# EAGLE design 5V AC-DC reg (EAGLE 9.6.2)
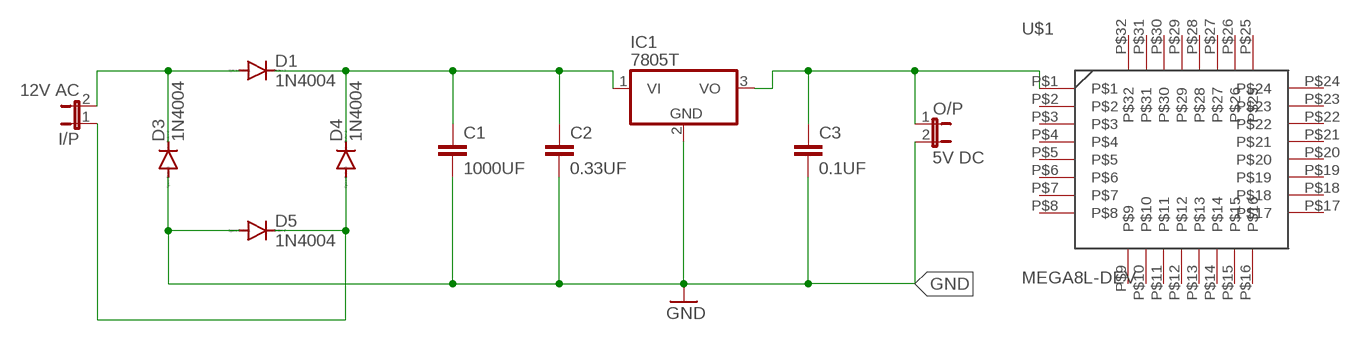
[diagram p0: schematic, sheet 1]

## Parts
C1  1000UF  C2,5-3  [C2.5-3]
C2  0.33UF  C2,5-3  [C2.5-3]
C3  0.1UF  C2,5-3  [C2.5-3]
D1  1N4004  [DO41-10]
D3  1N4004  [DO41-10]
D4  1N4004  [DO41-10]
D5  1N4004  [DO41-10]
I/P  12V AC  JP1E  [JP1]
IC1  7805T  [TO220H]
O/P  5V DC  JP1E  [JP1]
U$1  MEGA8L-DEV  [TQFP-MEGA8L]

## Nets
GND: C1.2 C2.2 C3.2 D3.A D5.A IC1.2(GND) O/P.2
N$1: D1.A D3.C I/P.2
N$2: C1.1 C2.1 D1.C D4.C IC1.1(VI)
N$3: D4.A D5.C I/P.1
N$5: C3.1 IC1.3(VO) O/P.1 U$1.P$1
Unconnected: U$1.P$2 U$1.P$3 U$1.P$4 U$1.P$5 U$1.P$6 U$1.P$7 U$1.P$8 U$1.P$9 U$1.P$10 U$1.P$11 U$1.P$12 U$1.P$13 U$1.P$14 U$1.P$15 U$1.P$16 U$1.P$17 U$1.P$18 U$1.P$19 U$1.P$20 U$1.P$21 U$1.P$22 U$1.P$23 U$1.P$24 U$1.P$25 U$1.P$26 U$1.P$27 U$1.P$28 U$1.P$29 U$1.P$30 U$1.P$31 U$1.P$32

## Library data of the parts
C1-C3 = capacitor-wima:C: CAPACITOR naming: grid - package width
D1 D3-D5 = diode:1N4004: DIODE general purpose rectifier, 1 A
I/P O/P = jumper:JP1E: JUMPER
IC1 = linear:78*: Positive VOLTAGE REGULATOR Source: http://cache.national.com/ds/LM/LM78L05.pdf http://www.fairchildsemi.com/ds/LM/LM7805.pdf
U$1 = SAN-MEGA8L:MEGA8L-DEV

## Board
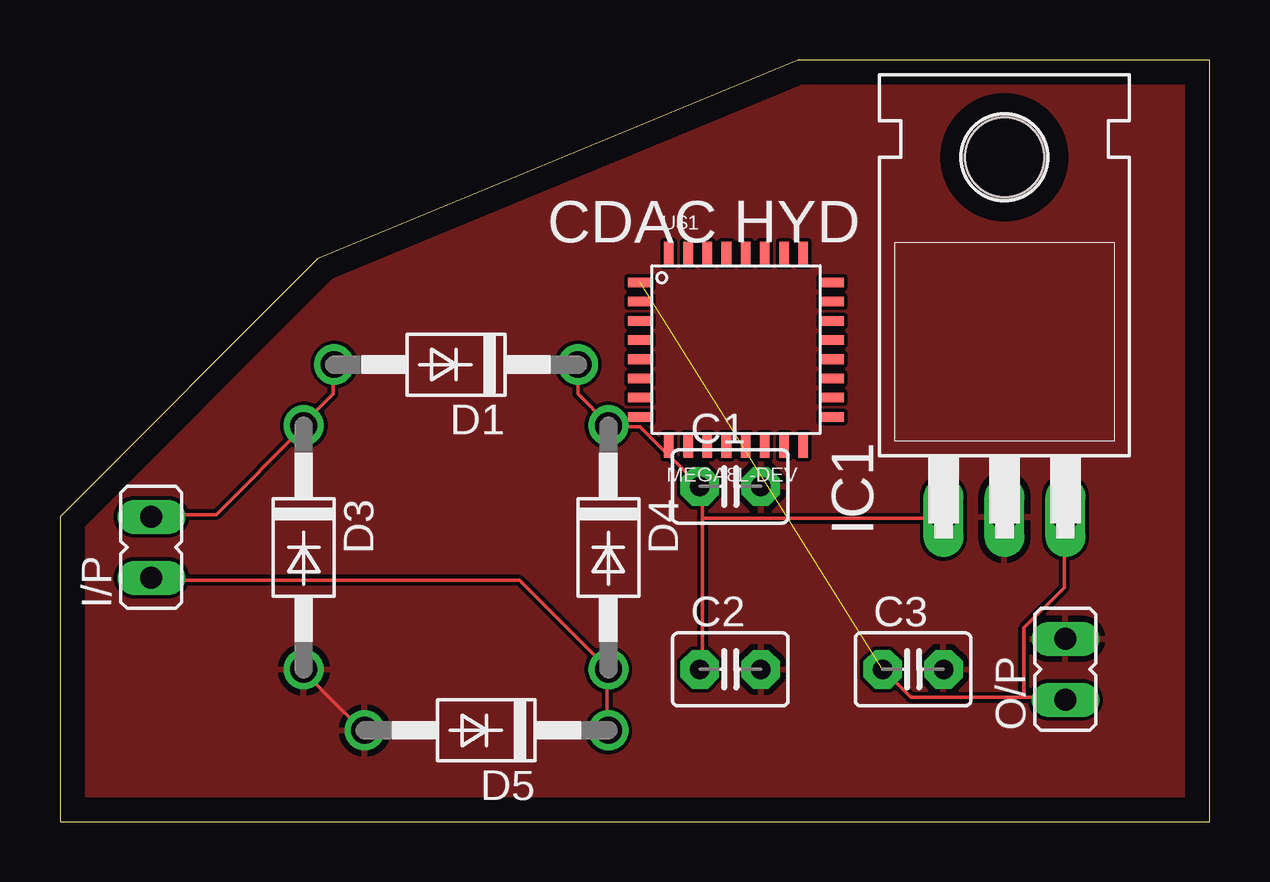
[diagram p1: board, top side]
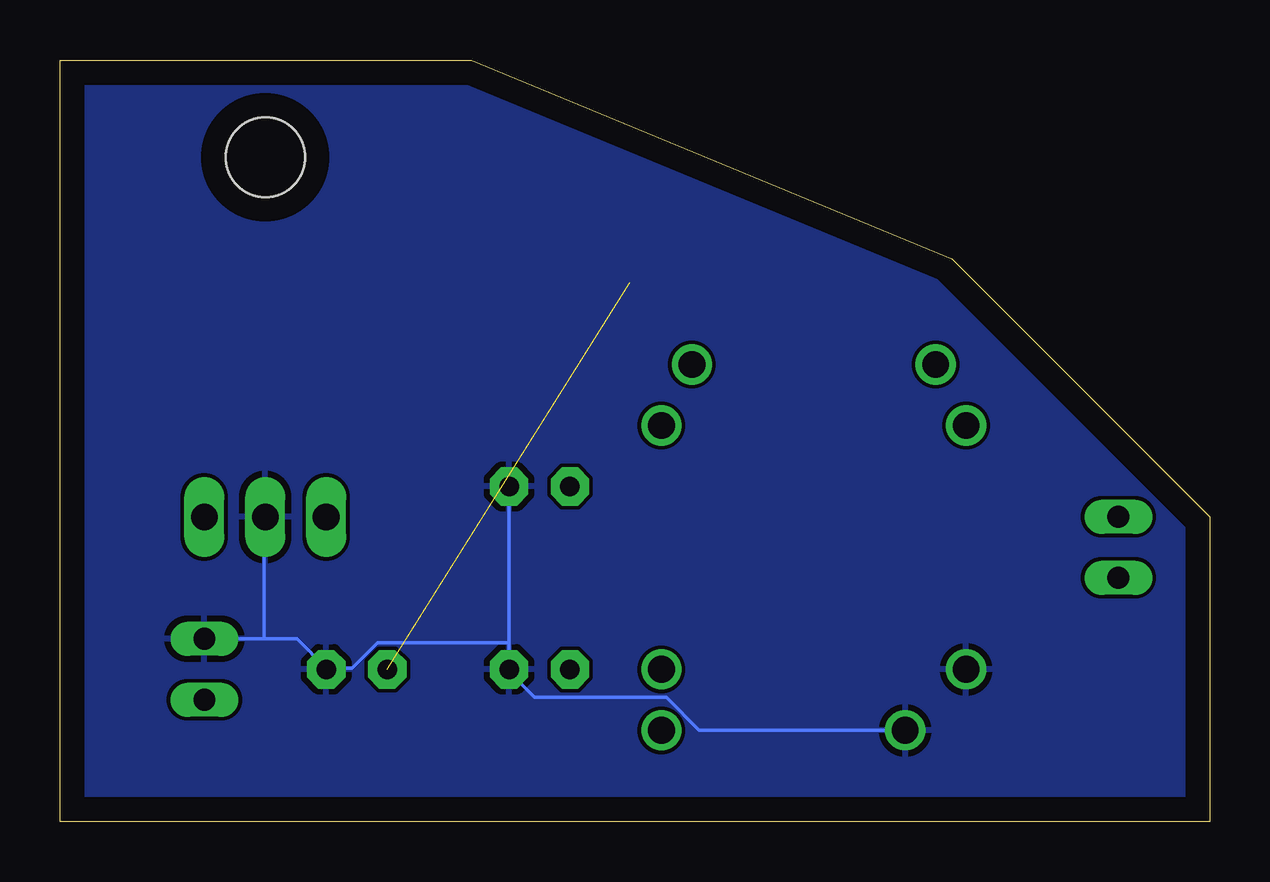
[diagram p2: board, bottom side, seen from below]

Size 47.93 x 31.74 mm. Coordinates in mm from the lower left corner, seen from the top.
Outline: 0,0 47.93,0 47.93,31.74 30.76,31.74 10.75,23.45 0,12.7 0,0
Copper layers (1*16): Top 0.035mm / dielectric 1.5mm / Bottom 0.035mm
Design rules "default": minimum track width 6mil, minimum drill 0.35mm, track to track 6mil, track to pad 6mil, pad to pad 6mil, via to via 6mil, smd to smd 6mil, copper to edge 40mil, drill to drill 6mil, minimum pad ring 10mil, minimum via ring 8mil, stop-mask expansion 4mil, vias tented up to drill 0mil, thermal gap 10mil

### Footprints (pad centres in the part's own frame; a part is rotated, then mirrored left to right if it is on the bottom)
C2.5-3 = drill 0.813 pad 1.6 octagon: 1 -1.27,0; 2 1.27,0
DO41-10 = drill 1.118: A 5.08,0; C -5.08,0
JP1 = drill 0.914 long: 1 0,-1.27; 2 0,1.27
TO220H = drill 1.118 long: 1 -2.54,-10.16; 2 0,-10.16; 3 2.54,-10.16 | hole 3.302: 0,4.826
TQFP-MEGA8L = smd 1 x 0.4: P$1 -6.3,8.5; P$2 -6.3,7.7; P$3 -6.3,6.9; P$4 -6.3,6.1; P$5 -6.3,5.3; P$6 -6.3,4.5; P$7 -6.3,3.7; P$8 -6.3,2.9; P$17 1.7,2.9; P$18 1.7,3.7; P$19 1.7,4.5; P$20 1.7,5.3; P$21 1.7,6.1; P$22 1.7,6.9; P$23 1.7,7.7; P$24 1.7,8.5 | smd 0.4 x 1: P$9 -5.1,1.7; P$10 -4.3,1.7; P$11 -3.5,1.7; P$12 -2.7,1.7; P$13 -1.9,1.7; P$14 -1.1,1.7; P$15 -0.3,1.7; P$16 0.5,1.7; P$25 0.5,9.7; P$26 -0.3,9.7; P$27 -1.1,9.7; P$28 -1.9,9.7; P$29 -2.7,9.7; P$30 -3.5,9.7; P$31 -4.3,9.7; P$32 -5.1,9.7

### Placement (x,y rotation side)
C1  27.94,13.97 0 top
C2  27.94,6.35 0 top
C3  35.56,6.35 0 top
D1  16.51,19.05 180 top
D3  10.16,11.43 270 top
D4  22.86,11.43 270 top
D5  17.78,3.81 180 top
I/P  3.81,11.43 0 top
IC1  39.37,22.86 0 top
O/P  41.91,6.35 0 top
U$1  30.48,13.97 0 top

### Tracks (layer width: path | path; a pad name or v marks a point on that pad's centre or on a via)
GND
  Top 0.152: D3.A 10.16,6.25 12.6,3.81 D5.A
  Bottom 0.152: 39.42,7.62 38.05,7.62 36.83,6.4 | 39.42,7.62 O/P.2 | 39.42,7.62 39.42,12.65 IC1.2 | C1.2 29.21,7.47 | 29.21,7.47 C2.2 29.21,6.25 28.14,5.18 22.66,5.18 21.29,3.81 D5.A | 36.83,6.4 35.76,6.4 34.7,7.47 29.21,7.47 | 36.83,6.4 C3.2
  pour Top: -3.81,33.02 49.53,33.02 49.53,-3.81 -3.81,-3.81
  pour Bottom: -7.62,35.56 50.8,35.56 50.8,-5.08 -7.62,-5.08
N$1
  Top 0.152: I/P.2 3.91,12.8 6.5,12.8 10.16,16.46 D3.C 10.16,16.61 11.38,17.83 11.38,19.05 D1.A
N$2
  Top 0.152: D1.C 21.59,17.83 22.81,16.61 D4.C 22.96,16.46 24.18,16.46 C1.1 26.77,13.87 26.77,12.65 | 26.77,12.65 26.77,6.4 C2.1 | 26.77,12.65 36.83,12.65 IC1.1
N$3
  Top 0.152: I/P.1 3.91,10.06 19.15,10.06 D4.A 22.81,6.25 22.81,3.81 D5.C
N$5  (1 unrouted)
  Top 0.152: 40.18,5.18 35.46,5.18 C3.1 | 40.18,5.18 41.86,5.18 O/P.1 | 40.18,5.18 40.18,8.08 41.86,9.75 41.86,12.65 IC1.3

### Text on the board
tPlace: CDAC HYD